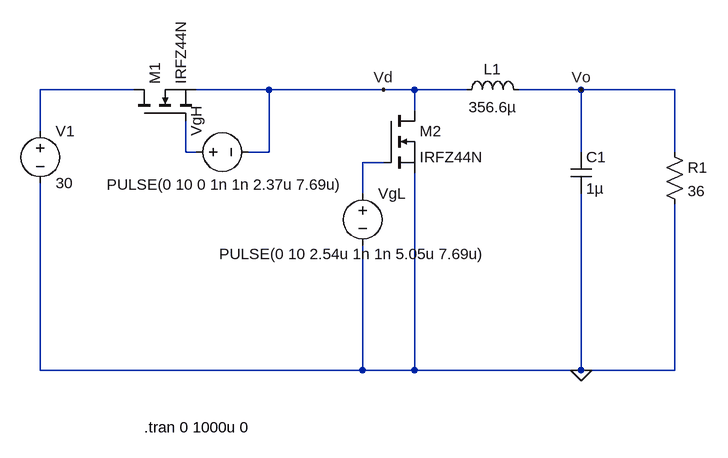
[diagram p0: schematic Buck-converter-30V.asc]
Buck-converter-30V.asc, the LTspice schematic file:
Version 4.1
SHEET 1 1500 680
WIRE 176 48 32 48
WIRE 384 48 272 48
WIRE 560 48 384 48
WIRE 608 48 560 48
WIRE 688 48 608 48
WIRE 864 48 768 48
WIRE 1008 48 864 48
WIRE 608 80 608 48
WIRE 32 112 32 48
WIRE 256 144 256 96
WIRE 272 144 256 144
WIRE 384 144 384 48
WIRE 384 144 352 144
WIRE 864 144 864 48
WIRE 1008 144 1008 48
WIRE 560 160 528 160
WIRE 528 208 528 160
WIRE 32 480 32 192
WIRE 528 480 528 288
WIRE 528 480 32 480
WIRE 608 480 608 176
WIRE 608 480 528 480
WIRE 864 480 864 208
WIRE 864 480 608 480
WIRE 1008 480 1008 224
WIRE 1008 480 864 480
FLAG 864 480 0
FLAG 864 48 Vo
FLAG 560 48 Vd
SYMBOL voltage 32 96 R0
WINDOW 123 0 0 Left 0
WINDOW 39 0 0 Left 0
SYMATTR InstName V1
SYMATTR Value 30
SYMBOL voltage 256 144 R270
WINDOW 3 -50 -122 VRight 2
WINDOW 123 0 0 Left 0
WINDOW 39 0 0 Left 0
SYMATTR Value PULSE(0 10 0 1n 1n 2.37u 7.69u)
SYMATTR InstName VgH
SYMBOL ind 672 64 R270
WINDOW 0 32 56 VTop 2
WINDOW 3 5 56 VBottom 2
SYMATTR InstName L1
SYMATTR Value 356.6µ
SYMBOL cap 848 144 R0
SYMATTR InstName C1
SYMATTR Value 1µ
SYMBOL res 992 128 R0
SYMATTR InstName R1
SYMATTR Value 36
SYMBOL nmos 560 80 R0
SYMATTR InstName M2
SYMATTR Value IRFZ44N
SYMBOL nmos 176 96 R270
SYMATTR InstName M1
SYMATTR Value IRFZ44N
SYMBOL voltage 528 192 R0
WINDOW 3 -221 109 Left 2
SYMATTR Value PULSE(0 10 2.54u 1n 1n 5.05u 7.69u)
SYMATTR InstName VgL
TEXT 192 568 Left 2 !.tran 0 1000u 0

The netlist it stands for:
* Buck-converter-30V.asc
V1 N001 0 30
VgH N002 Vd PULSE(0 10 0 1n 1n 2.37u 7.69u)
L1 Vd Vo 356.6µ
C1 Vo 0 1µ
R1 Vo 0 36
M2 Vd N003 0 0 IRFZ44N
M1 N001 N002 Vd Vd IRFZ44N
VgL N003 0 PULSE(0 10 2.54u 1n 1n 5.05u 7.69u)
.model NMOS NMOS
.model PMOS PMOS
.lib standard.mos
.tran 0 1000u 0
.backanno
.end